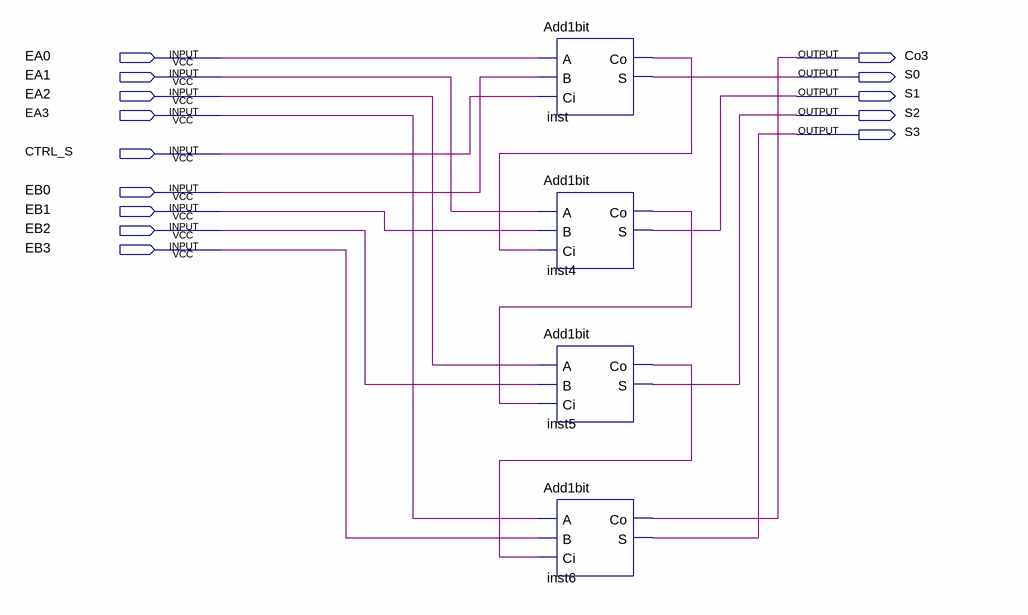
[diagram p0: schematic sheet]
// Quartus schematic Add4bit.bdf as structural Verilog: 4 symbols, 14 pins
module Add4bit (
  input  EA0,
  input  EA1,
  input  EA2,
  input  EA3,
  input  CTRL_S,
  input  EB0,
  input  EB1,
  input  EB2,
  input  EB3,
  output Co3,
  output S0,
  output S1,
  output S2,
  output S3
);

  wire inst4_co, inst5_co, inst_co;

  Add1bit inst (.A(EA0), .B(EB0), .Ci(CTRL_S), .Co(inst_co), .S(S0));
  Add1bit inst4 (.A(EA1), .B(EB1), .Ci(inst_co), .Co(inst4_co), .S(S1));
  Add1bit inst5 (.A(EA2), .B(EB2), .Ci(inst4_co), .Co(inst5_co), .S(S2));
  Add1bit inst6 (.A(EA3), .B(EB3), .Ci(inst5_co), .Co(Co3), .S(S3));
endmodule
